# Altium project RFSOC_SAWG.PrjPCB (part 2 of 10)

## Sheet FireFly_AB.SchDoc: RFSOC_SAWG
size 420 x 297 mm; PageSetup: Record=PageOptions|CenterHorizontal=True|CenterVertical=True|PrintScale=0.97|XCorrection=1.00|YCorrection=1.00|PrintKind=0|BorderSize=5000000|LeftOffset=0|BottomOffset=0|Orientation=2|PaperLength=2970|PaperWidth=2100|Scale=100|PaperSource=7|PrintQuality=-4|MediaType=1|DitherType=10|PrintScaleMode=1|PaperKind=A4|PaperIndex=9; Author: G.Kasprowicz; CompanyName: WUT ISE; DrawnBy: G.Kasprowicz; Organization: WUT ISE; Address1: PW ISE; Address2: Nowowiejska 15/19 00-665 Warsaw; Address3: gkasprow@gmail.com; DocumentNumber: 13; Revision: 1; SheetNumber: 13; SheetTotal: 20; ModifiedBy: -; CheckedDate: -; Title2: FireFly AB; DivGrp: WUT ISE; Designer: G.Kasprowicz; ModifiedDate: -; ProjectName: Sensor Box
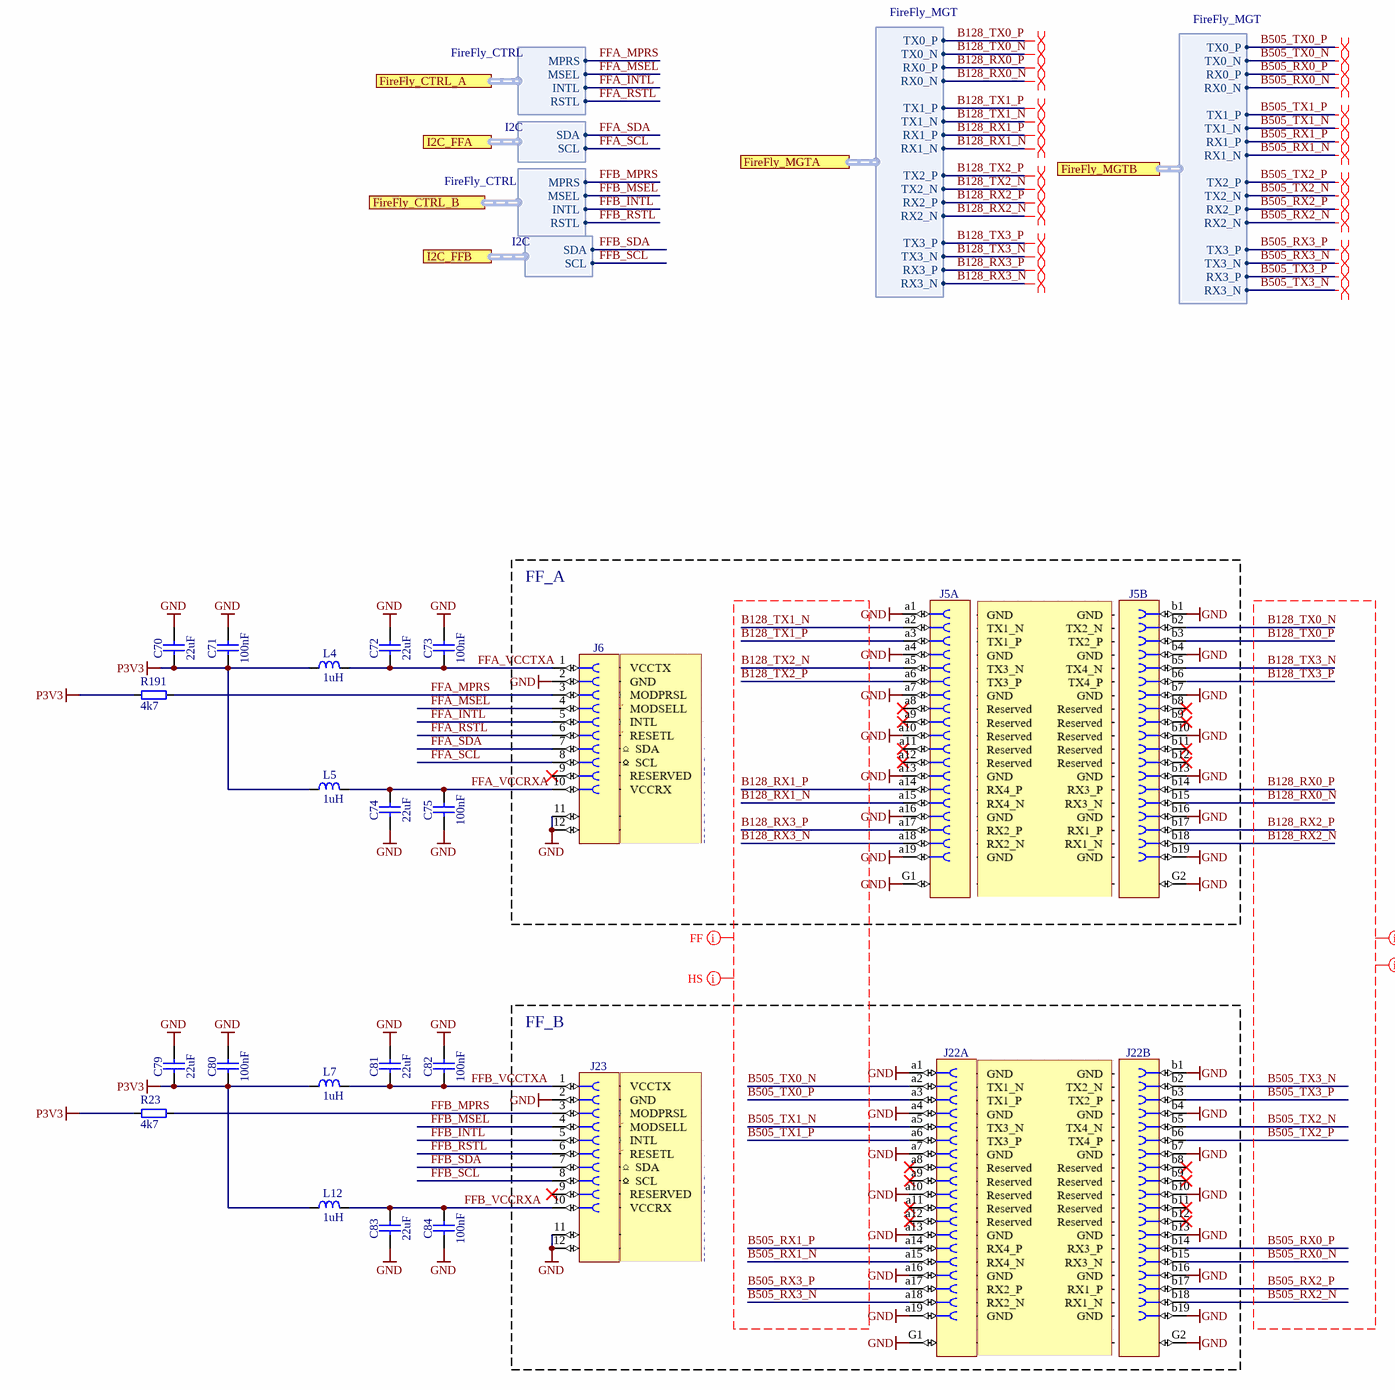
[diagram p2: FireFly_AB.SchDoc]

### Parts
C70  22uF  [CAPC2012X135N]
C71  100nF  [CAPC1005X55N]
C72  22uF  [CAPC2012X135N]
C73  100nF  [CAPC1005X55N]
C74  22uF  [CAPC2012X135N]
C75  100nF  [CAPC1005X55N]
C79  22uF  [CAPC2012X135N]
C80  100nF  [CAPC1005X55N]
C81  22uF  [CAPC2012X135N]
C82  100nF  [CAPC1005X55N]
C83  22uF  [CAPC2012X135N]
C84  100nF  [CAPC1005X55N]
J5  Socket 38  [SAMTEC_UEC5-019-2-H-D-RA-1]  (value not drawn)  (parts A,B of 2)
J6  Socket 10  [SAMTEC_UCC8-010-1-H-S-1-A]  (value not drawn)
J22  Socket 38  [SAMTEC_UEC5-019-2-H-D-RA-1]  (value not drawn)  (parts A,B of 2)
J23  Socket 10  [SAMTEC_UCC8-010-1-H-S-1-A]  (value not drawn)
L4  1uH  [INDC2520X120N]
L5  1uH  [INDC2520X120N]
L7  1uH  [INDC2520X120N]
L12  1uH  [INDC2520X120N]
R23  4k7  [RESC1005X40N]
R191  4k7  [RESC1005X40N]

### Blocks framed on the sheet
FF_A: J5 J6
FF_B: J22 J23

### Ports
FireFly_CTRL_A (harness FireFly_CTRL), FireFly_CTRL_B (harness FireFly_CTRL), FireFly_MGTA (harness FireFly_MGT), FireFly_MGTB (harness FireFly_MGT), I2C_FFA (harness I2C), I2C_FFB (harness I2C)

### Harnesses
I2C: SDA, SCL
FireFly_MGT: RX1_P, RX1_N, RX2_P, RX2_N, RX3_P, RX3_N, RX0_P, RX0_N, TX1_P, TX1_N, TX2_P, TX2_N, TX3_P, TX3_N, TX0_P, TX0_N
FireFly_CTRL: MPRS, MSEL, INTL, RSTL

### Nets
GND: C70.2 C71.2 C72.2 C73.2 C74.1 C75.1 C79.2 C80.2 C81.2 C82.2 C83.1 C84.1 J5.a1 J5.a4 J5.a7 J5.a10 J5.a13 J5.a16 J5.a19 J5.b1 J5.b4 J5.b7 J5.b10 J5.b13 J5.b16 J5.b19 J5.G1 J5.G2 J6.2 J6.11 J6.12 J22.a1 J22.a4 J22.a7 J22.a10 J22.a13 J22.a16 J22.a19 J22.b1 J22.b4 J22.b7 J22.b10 J22.b13 J22.b16 J22.b19 J22.G1 J22.G2 J23.2 J23.11 J23.12
P3V3: C70.1 C71.1 C79.1 C80.1 L4.1 L5.1 L7.1 L12.1 R23.1 R191.1
B128_RX0_N: J5.b15 ; port FireFly_MGTA.RX0_N
B128_RX0_P: J5.b14 ; port FireFly_MGTA.RX0_P
B128_RX1_N: J5.a15 ; port FireFly_MGTA.RX1_N
B128_RX1_P: J5.a14 ; port FireFly_MGTA.RX1_P
B128_RX2_N: J5.b18 ; port FireFly_MGTA.RX2_N
B128_RX2_P: J5.b17 ; port FireFly_MGTA.RX2_P
B128_RX3_N: J5.a18 ; port FireFly_MGTA.RX3_N
B128_RX3_P: J5.a17 ; port FireFly_MGTA.RX3_P
B128_TX0_N: J5.b2 ; port FireFly_MGTA.TX0_N
B128_TX0_P: J5.b3 ; port FireFly_MGTA.TX0_P
B128_TX1_N: J5.a2 ; port FireFly_MGTA.TX1_N
B128_TX1_P: J5.a3 ; port FireFly_MGTA.TX1_P
B128_TX2_N: J5.a5 ; port FireFly_MGTA.TX2_N
B128_TX2_P: J5.a6 ; port FireFly_MGTA.TX2_P
B128_TX3_N: J5.b5 ; port FireFly_MGTA.TX3_N
B128_TX3_P: J5.b6 ; port FireFly_MGTA.TX3_P
B505_RX0_N: J22.b15 ; port FireFly_MGTB.RX0_N
B505_RX0_P: J22.b14 ; port FireFly_MGTB.RX0_P
B505_RX1_N: J22.a15 ; port FireFly_MGTB.RX1_N
B505_RX1_P: J22.a14 ; port FireFly_MGTB.RX1_P
B505_RX2_N: J22.b18 ; port FireFly_MGTB.RX2_N
B505_RX2_P: J22.b17 ; port FireFly_MGTB.RX2_P
B505_RX3_N: J22.a18 ; port FireFly_MGTB.TX3_N
B505_RX3_P: J22.a17 ; port FireFly_MGTB.TX3_P
B505_TX0_N: J22.a2 ; port FireFly_MGTB.TX0_N
B505_TX0_P: J22.a3 ; port FireFly_MGTB.TX0_P
B505_TX1_N: J22.a5 ; port FireFly_MGTB.TX1_N
B505_TX1_P: J22.a6 ; port FireFly_MGTB.TX1_P
B505_TX2_N: J22.b5 ; port FireFly_MGTB.TX2_N
B505_TX2_P: J22.b6 ; port FireFly_MGTB.TX2_P
B505_TX3_N: J22.b2 ; port FireFly_MGTB.RX3_N
B505_TX3_P: J22.b3 ; port FireFly_MGTB.RX3_P
FFA_INTL: J6.5 ; port FireFly_CTRL_A.INTL
FFA_MPRS: J6.3 R191.2 ; port FireFly_CTRL_A.MPRS
FFA_MSEL: J6.4 ; port FireFly_CTRL_A.MSEL
FFA_RSTL: J6.6 ; port FireFly_CTRL_A.RSTL
FFA_SCL: J6.8 ; port I2C_FFA.SCL
FFA_SDA: J6.7 ; port I2C_FFA.SDA
FFA_VCCRXA: C74.2 C75.2 J6.10 L5.2
FFA_VCCTXA: C72.1 C73.1 J6.1 L4.2
FFB_INTL: J23.5 ; port FireFly_CTRL_B.INTL
FFB_MPRS: J23.3 R23.2 ; port FireFly_CTRL_B.MPRS
FFB_MSEL: J23.4 ; port FireFly_CTRL_B.MSEL
FFB_RSTL: J23.6 ; port FireFly_CTRL_B.RSTL
FFB_SCL: J23.8 ; port I2C_FFB.SCL
FFB_SDA: J23.7 ; port I2C_FFB.SDA
FFB_VCCRXA: C83.2 C84.2 J23.10 L12.2
FFB_VCCTXA: C81.1 C82.1 J23.1 L7.2

Not connected (* = marked no-connect by the designer): J5 a8(8)* a9(9)* a11(11)* a12(12)* b8(8)* b9(9)* b11(11)* b12(12)*; J6 9*; J22 a8(8)* a9(9)* a11(11)* a12(12)* b8(8)* b9(9)* b11(11)* b12(12)*; J23 9*

### Layout directives
net class HS: B128_RX0_N, B128_RX0_P, B128_RX1_N, B128_RX1_P, B128_RX2_N, B128_RX2_P, B128_RX3_N, B128_RX3_P, B128_TX0_N, B128_TX0_P, B128_TX1_N, B128_TX1_P, B128_TX2_N, B128_TX2_P, B128_TX3_N, B128_TX3_P, B505_RX0_N, B505_RX0_P, B505_RX1_N, B505_RX1_P, B505_RX2_N, B505_RX2_P, B505_RX3_N, B505_RX3_P, B505_TX0_N, B505_TX0_P, B505_TX1_N, B505_TX1_P, B505_TX2_N, B505_TX2_P, B505_TX3_N, B505_TX3_P
net class FF: B128_RX0_N, B128_RX0_P, B128_RX1_N, B128_RX1_P, B128_RX2_N, B128_RX2_P, B128_RX3_N, B128_RX3_P, B128_TX0_N, B128_TX0_P, B128_TX1_N, B128_TX1_P, B128_TX2_N, B128_TX2_P, B128_TX3_N, B128_TX3_P, B505_RX0_N, B505_RX0_P, B505_RX1_N, B505_RX1_P, B505_RX2_N, B505_RX2_P, B505_RX3_N, B505_RX3_P, B505_TX0_N, B505_TX0_P, B505_TX1_N, B505_TX1_P, B505_TX2_N, B505_TX2_P, B505_TX3_N, B505_TX3_P
differential pair: B128_RX0_N, B128_RX0_P, B128_RX1_N, B128_RX1_P, B128_RX2_N, B128_RX2_P, B128_RX3_N, B128_RX3_P, B128_TX0_N, B128_TX0_P, B128_TX1_N, B128_TX1_P, B128_TX2_N, B128_TX2_P, B128_TX3_N, B128_TX3_P, B505_RX0_N, B505_RX0_P, B505_RX1_N, B505_RX1_P, B505_RX2_N, B505_RX2_P, B505_RX3_N, B505_RX3_P, B505_TX0_N, B505_TX0_P, B505_TX1_N, B505_TX1_P, B505_TX2_N, B505_TX2_P, B505_TX3_N, B505_TX3_P

### Notes on the sheet
- Project/Equipment
- Document
- Designer
- Drawn by
- Check.by
- Copyright WUT ISE 2020.
  This documentation describes Open Hardware and is licensed under the CERN OHL v.1.2. You may redistribute and modify this documentation under the terms of the CERN OHL v.1.2. (http://ohwr.org/CERNOHL). This documentation is distributed WITHOUT ANY EXPRESS OR IMPLIED WARRANTY, INCLUDING OF MERCHANTABILITY, SATISFACTORY QUALITY AND FITNESS FOR A PARTICULAR PURPOSE. Please see the CERN OHL v.1.2 for applicable conditions.
- Contact
- File
- Last Mod.
- Print Date
- Sheet
- Size
- A3
- of
- Rev

### Library data of the parts
C70 C72 C74 C79 C81 C83 = CC0805_22UF_16V_10%_X5R: Non-polarised capacitor; Part Description: SMD Multilayer Chip Ceramic Capacitor; Manufacturer: GENERIC; Manufacturer1 Part Number: C2012X5R1C226KT; Voltage: 16V; TC: X5R; Tolerance: ±10%; Part Number: CC0805_22UF_16V_10%_X5R; Component Kind: Standard; Component Type: Standard; Pin Count: 2; Value: 22uF; Status: Preferred; Manufacturer Part Number: CC0805_22UF_16V_10%_X5R; Case: 0805; Mounted: Yes; Socket: No; SMD: Yes; Sense: No; Manufacturer1 Example: TDK; Manufacturer1 ComponentHeight: 1.35mm; HelpURL: \\cern.ch\dfs\Applications\Altium\Datasheets\CC0805_X5R_TDK_C.pdf; Author: CERN DEM JLC; CreateDate: 25.10.2012; LatestRevisionDate: 25.10.2012
C71 C73 C75 C80 C82 C84 = CC0402_100NF_16V_10%_X7R: as C225 on sheet AWG_CLK_Connectors; Part Number: CC0402_100NF_16V_10%_X7R; Component Kind: Standard; Component Type: Standard; Pin Count: 2; Value: 100nF; Status: Not Recommended; Manufacturer Part Number: CC0402_100NF_16V_10%_X7R; Case: 0402; Mounted: Yes; Socket: No; SMD: Yes; Sense: No; Manufacturer1 Example: MURATA; Manufacturer1 ComponentHeight: 0.55mm; HelpURL: \\cern.ch\dfs\Applications\Altium\Datasheets\CC0402_X7R_MURATA_GRM.pdf; Author: CERN DEM JLC; CreateDate: 05/12/2013; LatestRevisionDate: 03/12/2007
J5 J22 = SAMTEC_UEC5-019-2-H-D-RA-1: Connector 38ab Female (2x19) + 2x1; Part Description: 38 Contacts, Pitch 0.5mm, Rugged Micro Flyover Socket System; Manufacturer: SAMTEC; PressFit: No; Part Number: SAMTEC_UEC5-019-2-H-D-RA-1; Component Kind: Standard; Component Type: Standard; Pin Count: 38; Family: Socket 38; Mounted: Yes; Socket: No; SMD: Yes; Sense: No; Status: None; Manufacturer Part Number: UEC5-019-2-H-D-RA-1; ComponentHeight: 3.46mm; HelpURL: \\cern.ch\dfs\Applications\Altium\Datasheets\SAMTEC_UEC5-019-2-H-D-RA-1.pdf; Author: CERN DEM BR; CreateDate: 06.06.2019; LatestRevisionDate: 06.06.2019
J6 J23 = SAMTEC_UCC8-010-1-H-S-1-A: Connector 10 Female + 2; Part Description: 10 Contacts, Pitch 0.8mm, Rugged Micro Flyover Socket System; Manufacturer: SAMTEC; PressFit: No; Part Number: SAMTEC_UCC8-010-1-H-S-1-A; Component Kind: Standard; Component Type: Standard; Pin Count: 10; Family: Socket 10; Mounted: Yes; Socket: No; SMD: Yes; Sense: No; Status: None; Manufacturer Part Number: UCC8-010-1-H-S-1-A; ComponentHeight: 3.95mm; HelpURL: \\cern.ch\dfs\Applications\Altium\Datasheets\SAMTEC_UCC8-010-1-H-S-1-A.pdf; Author: CERN DEM JLC; CreateDate: 09.06.2015; LatestRevisionDate: 09.06.2015
L4 L5 L7 L12 = IND1008_1UH_20%_TDK_TFM252012ALVA1R0M: Inductor; Part Description: Inductors for Power Circuits Thin-Film Metal Magnetic Material (TFM-ALVA Series for Automotive); Manufacturer: TDK; Tolerance: ±20%; Power: 4.7A; Resistance: 0.035R; Case: 1008; Value: 1uH; HelpURL: \\cern.ch\dfs\Applications\Altium\Datasheets\IND_TDK_TFM252012ALVA.pdf; Part Number: IND1008_1UH_20%_TDK_TFM252012ALVA1R0M; Component Kind: Standard; Component Type: Standard; Pin Count: 2; Manufacturer Part Number: TFM252012ALVA1R0M; Mounted: Yes; Socket: No; SMD: Yes; Sense: No; ComponentHeight: 1.2mm; Author: CERN DEM BC; CreateDate: 16.04.2020; LatestRevisionDate: 16.04.2020
R23 R191 = R0402_4K7_1%_0.0625W_100PPM: Resistor - 1%; Part Description: General Purpose Thick Film Chip Resistor; Manufacturer: GENERIC; Manufacturer1 Part Number: 232270674702L; TC: ±100ppm/°C; PressFit: No; Case: 0402; Value: 4k7; Tolerance: ±1%; Part Number: R0402_4K7_1%_0.0625W_100PPM; Component Kind: Standard; Component Type: Standard; Pin Count: 2; Status: Not Recommended; Power: 0.0625W; Manufacturer Part Number: R0402_4K7_1%_0.0625W_100PPM; Mounted: Yes; Sense: No; Socket: No; SMD: Yes; Manufacturer1 Example: YAGEO PHYCOMP; Manufacturer1 ComponentHeight: 0.4mm; HelpURL: \\cern.ch\dfs\Applications\Altium\Datasheets\R0402_Phycomp_RC0402.pdf; Author: CERN DEM JLC; CreateDate: 03.12.2007; LatestRevisionDate: 17.10.2012

## Sheet I2C_MUX.SchDoc: RFSOC_SAWG
size 420 x 297 mm; Author: G.Kasprowicz; CompanyName: WUT ISE; DrawnBy: G.Kasprowicz; Organization: WUT ISE; Address1: PW ISE; Address2: Nowowiejska 15/19 00-665 Warsaw; Address3: gkasprow@gmail.com; DocumentNumber: 14; Revision: 1; SheetNumber: 14; SheetTotal: 20; ModifiedBy: -; CheckedDate: -; Title2: I2C_MUX; DivGrp: WUT ISE; Designer: G.Kasprowicz; ModifiedDate: -; ProjectName: Sensor Box
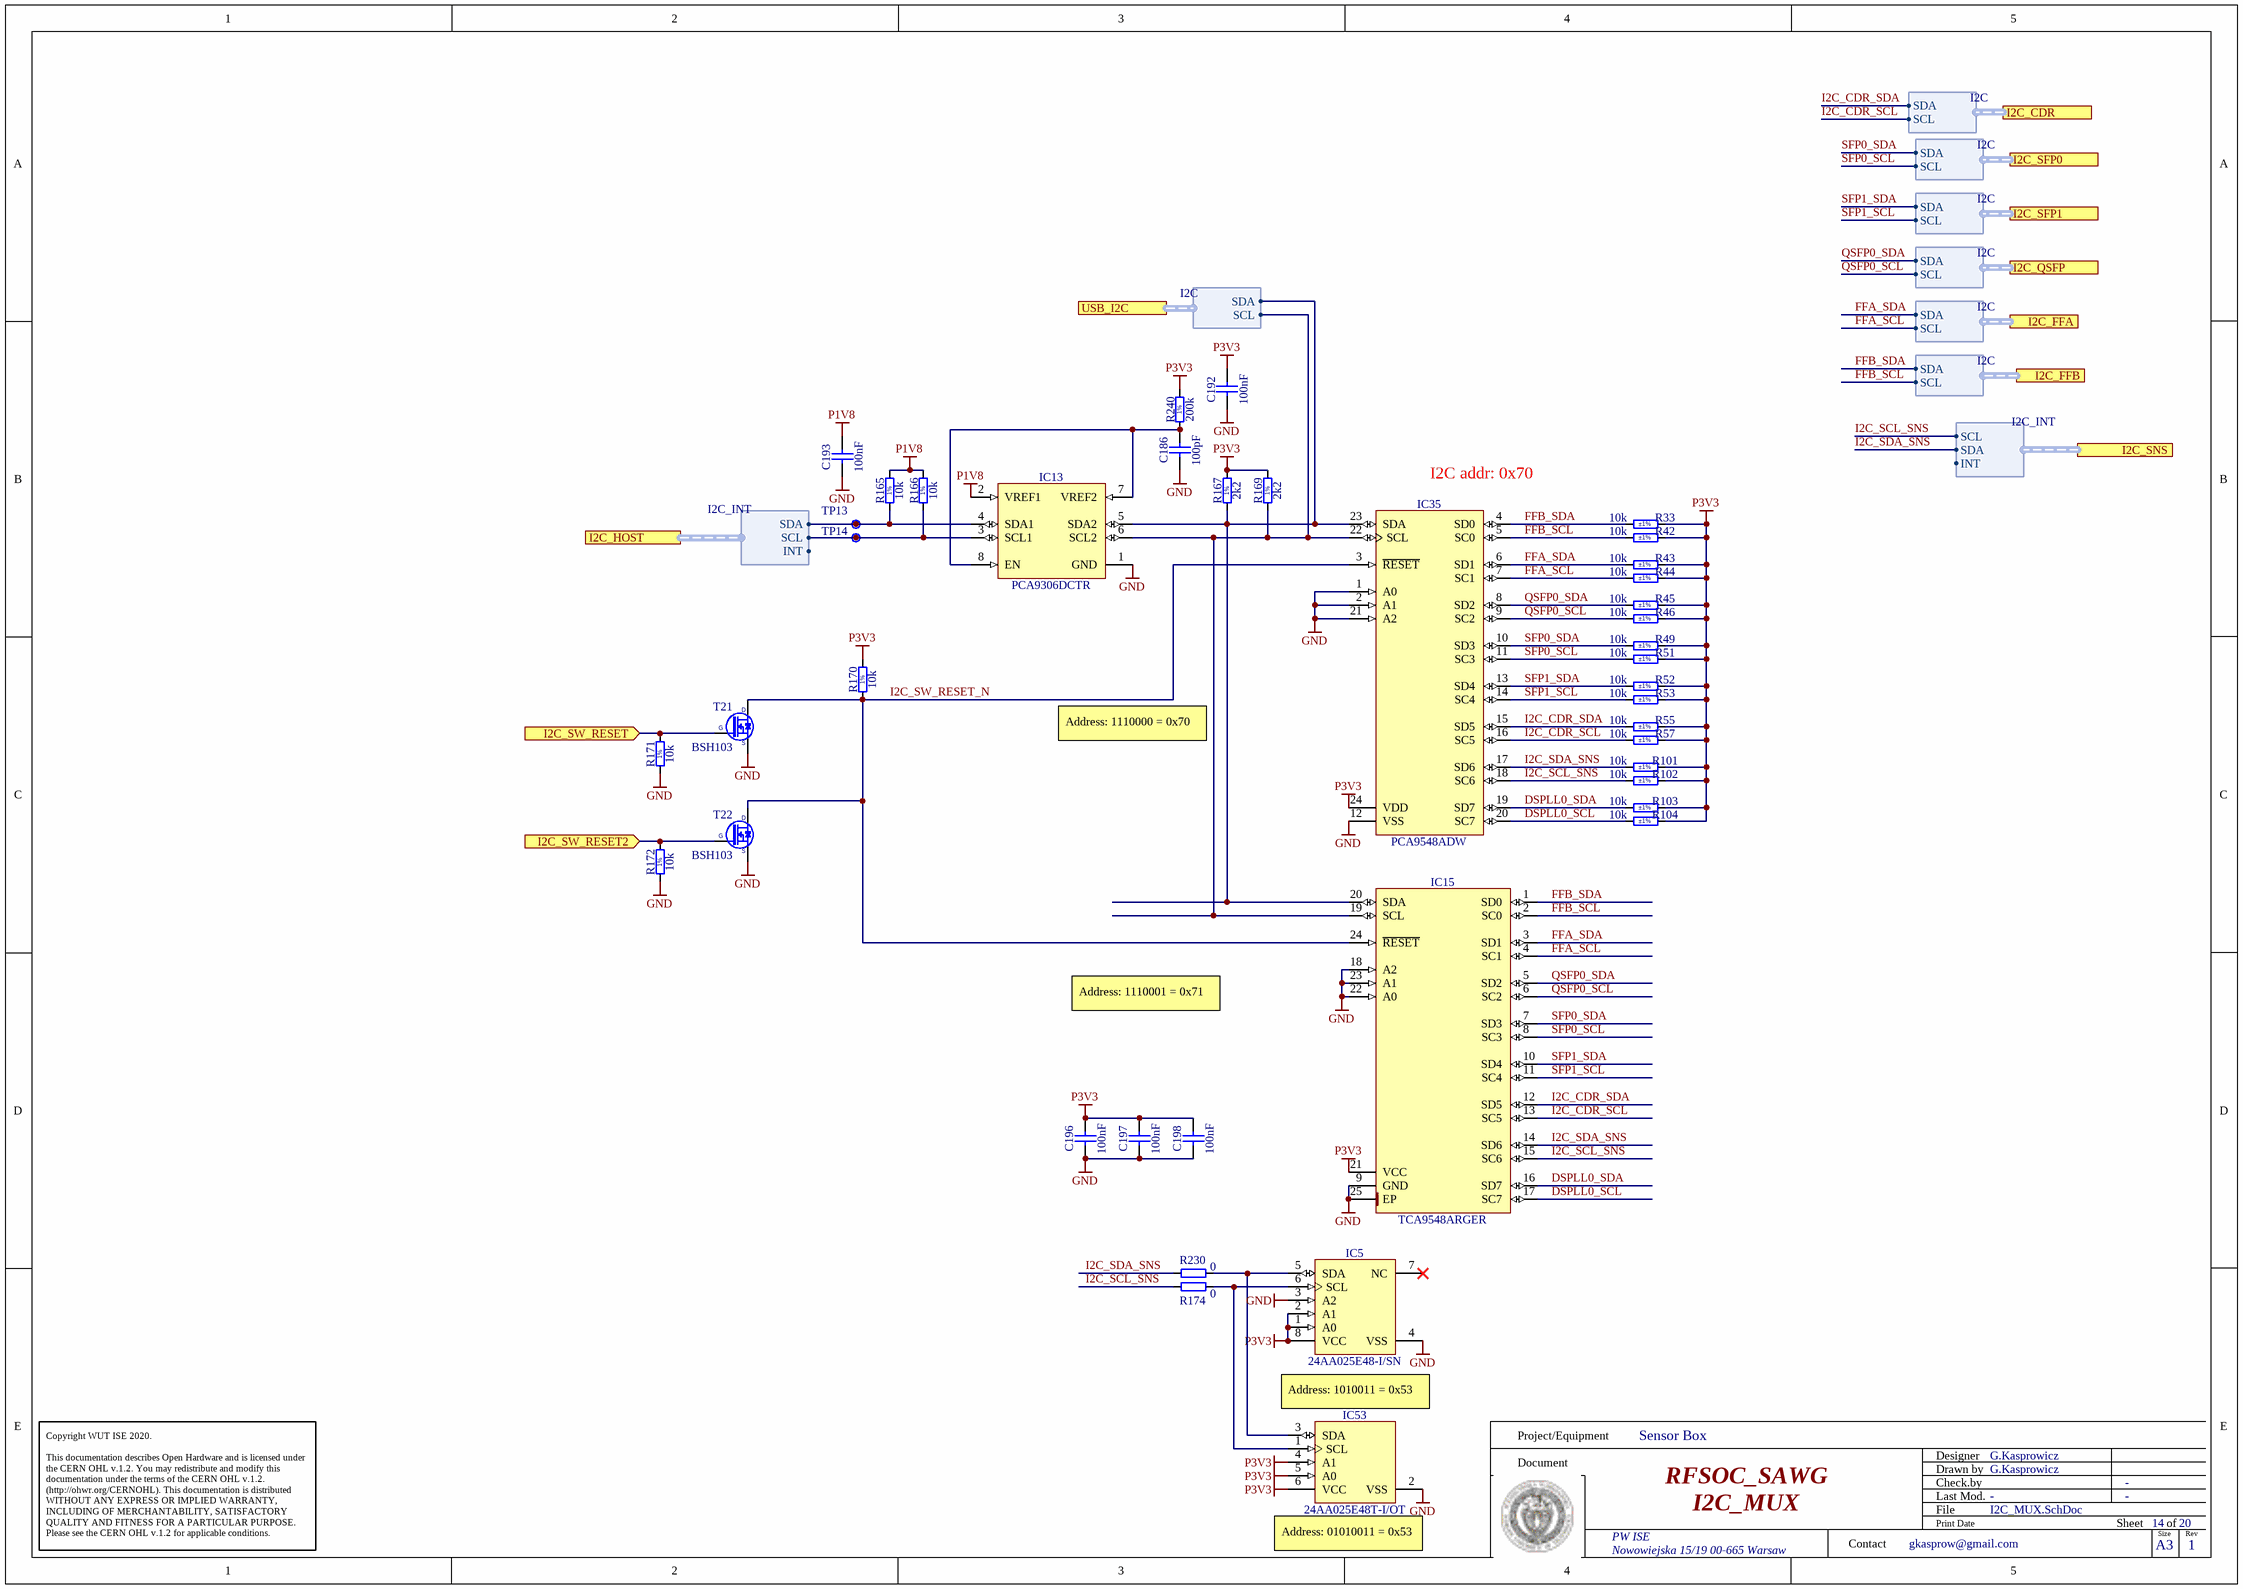
[diagram p3: I2C_MUX.SchDoc]

### Parts
C186  100pF  [CAPC1005X55N]
C192  100nF  [CAPC1005X55N]
C193  100nF  [CAPC1005X55N]
C196  100nF  [CAPC1005X55N]
C197  100nF  [CAPC1005X55N]
C198  100nF  [CAPC1005X55N]
IC5  24AA025E48-I/SN  [SOIC127P600X175-8N]
IC13  PCA9306DCTR  [SOP65P400X130-8N]
IC15  TCA9548ARGER  [QFN50P400X400X100-25N-S220]
IC35  PCA9548ADW  [SOIC127P1030X265-24N]
IC53  24AA025E48T-I/OT  [SOT95P280X145-6N]
R33  10k  Tolerance: ±1%  [RESC1005X40N]
R42  10k  Tolerance: ±1%  [RESC1005X40N]
R43  10k  Tolerance: ±1%  [RESC1005X40N]
R44  10k  Tolerance: ±1%  [RESC1005X40N]
R45  10k  Tolerance: ±1%  [RESC1005X40N]
R46  10k  Tolerance: ±1%  [RESC1005X40N]
R49  10k  Tolerance: ±1%  [RESC1005X40N]
R51  10k  Tolerance: ±1%  [RESC1005X40N]
R52  10k  Tolerance: ±1%  [RESC1005X40N]
R53  10k  Tolerance: ±1%  [RESC1005X40N]
R55  10k  Tolerance: ±1%  [RESC1005X40N]
R57  10k  Tolerance: ±1%  [RESC1005X40N]
R101  10k  Tolerance: ±1%  [RESC1005X40N]
R102  10k  Tolerance: ±1%  [RESC1005X40N]
R103  10k  Tolerance: ±1%  [RESC1005X40N]
R104  10k  Tolerance: ±1%  [RESC1005X40N]
R165  10k  [RESC1005X40N]
R166  10k  [RESC1005X40N]
R167  2k2  [RESC1005X40N]
R169  2k2  [RESC1005X40N]
R170  10k  [RESC1005X40N]
R171  10k  [RESC1005X40N]
R172  10k  [RESC1005X40N]
R174  0  [RESC1005X40N]
R230  0  [RESC1005X40N]
R240  200k  [RESC1005X40N]
T21  BSH103  [SOT95P230X110-3N]
T22  BSH103  [SOT95P230X110-3N]
TP13  Test Point  [TPS127]  (value not drawn)  (no BOM)
TP14  Test Point  [TPS127]  (value not drawn)  (no BOM)

### Ports
I2C_CDR (harness I2C), I2C_FFA (harness I2C), I2C_FFB (harness I2C), I2C_HOST (harness I2C_INT), I2C_QSFP (harness I2C), I2C_SFP0 (harness I2C), I2C_SFP1 (harness I2C), I2C_SNS (harness I2C_INT), I2C_SW_RESET2 (in), I2C_SW_RESET (in), USB_I2C (harness I2C)

### Harnesses
I2C: SDA, SCL
I2C_INT: SDA, SCL, INT

### Nets
GND: C186.1 C192.1 C193.1 C196.1 C197.1 C198.1 IC5.3(A2) IC5.4(VSS) IC13.1(GND) IC15.9(GND) IC15.18(A2) IC15.22(A0) IC15.23(A1) IC15.25(EP) IC35.1(A0) IC35.2(A1) IC35.12(VSS) IC35.21(A2) IC53.2(VSS) R171.1 R172.1 T21.2(S) T22.2(S)
P1V8: C193.2 IC13.2(VREF1) R165.2 R166.2
P3V3: C192.2 C196.2 C197.2 C198.2 IC5.1(A0) IC5.2(A1) IC5.8(VCC) IC15.21(VCC) IC35.24(VDD) IC53.4(A1) IC53.5(A0) IC53.6(VCC) R33.2 R42.2 R43.2 R44.2 R45.2 R46.2 R49.2 R51.2 R52.2 R53.2 R55.2 R57.2 R101.2 R102.2 R103.2 R104.2 R167.2 R169.2 R170.2 R240.2
ALERT_N: port I2C_HOST.INT, port I2C_SNS.INT
DSPLL0_SCL: IC15.17(SC7) IC35.20(SC7) R104.1
DSPLL0_SDA: IC15.16(SD7) IC35.19(SD7) R103.1
FFA_SCL: IC15.4(SC1) IC35.7(SC1) R44.1 ; port I2C_FFA.SCL
FFA_SDA: IC15.3(SD1) IC35.6(SD1) R43.1 ; port I2C_FFA.SDA
FFB_SCL: IC15.2(SC0) IC35.5(SC0) R42.1 ; port I2C_FFB.SCL
FFB_SDA: IC15.1(SD0) IC35.4(SD0) R33.1 ; port I2C_FFB.SDA
I2C0_1V8_SCL: IC13.3(SCL1) R166.1 TP14.1 ; port I2C_HOST.SCL
I2C0_1V8_SDA: IC13.4(SDA1) R165.1 TP13.1 ; port I2C_HOST.SDA
I2C_CDR_SCL: IC15.13(SC5) IC35.16(SC5) R57.1 ; port I2C_CDR.SCL
I2C_CDR_SDA: IC15.12(SD5) IC35.15(SD5) R55.1 ; port I2C_CDR.SDA
I2C_SCL_SNS: IC15.15(SC6) IC35.18(SC6) R102.1 R174.1 ; port I2C_SNS.SCL
I2C_SDA_SNS: IC15.14(SD6) IC35.17(SD6) R101.1 R230.1 ; port I2C_SNS.SDA
I2C_SW_RESET: R171.2 T21.1(G) ; port I2C_SW_RESET
I2C_SW_RESET2: R172.2 T22.1(G) ; port I2C_SW_RESET2
I2C_SW_RESET_N: IC15.24(~{RESET}) IC35.3(~{RESET}) R170.1 T21.3(D) T22.3(D)
QSFP0_SCL: IC15.6(SC2) IC35.9(SC2) R46.1 ; port I2C_QSFP.SCL
QSFP0_SDA: IC15.5(SD2) IC35.8(SD2) R45.1 ; port I2C_QSFP.SDA
SFP0_SCL: IC15.8(SC3) IC35.11(SC3) R51.1 ; port I2C_SFP0.SCL
SFP0_SDA: IC15.7(SD3) IC35.10(SD3) R49.1 ; port I2C_SFP0.SDA
SFP1_SCL: IC15.11(SC4) IC35.14(SC4) R53.1 ; port I2C_SFP1.SCL
SFP1_SDA: IC15.10(SD4) IC35.13(SD4) R52.1 ; port I2C_SFP1.SDA
USB_SCL: IC13.6(SCL2) IC15.19(SCL) IC35.22(SCL) R169.1 ; port USB_I2C.SCL
USB_SDA: IC13.5(SDA2) IC15.20(SDA) IC35.23(SDA) R167.1 ; port USB_I2C.SDA
NetC186_2: C186.2 IC13.7(VREF2) IC13.8(EN) R240.1
NetIC5_5: IC5.5(SDA) IC53.3(SDA) R230.2
NetIC5_6: IC5.6(SCL) IC53.1(SCL) R174.2

Not connected (* = marked no-connect by the designer): IC5 7(NC)*

### Notes on the sheet
- (near IC35) I2C addr: 0x70
- Address: 1110000 = 0x70
- Address: 1110001 = 0x71
- Address: 1010011 = 0x53
- (near IC53) Address: 01010011 = 0x53
- Project/Equipment
- Document
- Designer
- Drawn by
- Check.by
- Copyright WUT ISE 2020.
  This documentation describes Open Hardware and is licensed under the CERN OHL v.1.2. You may redistribute and modify this documentation under the terms of the CERN OHL v.1.2. (http://ohwr.org/CERNOHL). This documentation is distributed WITHOUT ANY EXPRESS OR IMPLIED WARRANTY, INCLUDING OF MERCHANTABILITY, SATISFACTORY QUALITY AND FITNESS FOR A PARTICULAR PURPOSE. Please see the CERN OHL v.1.2 for applicable conditions.
- Contact
- File
- Last Mod.
- Print Date
- Sheet
- Size
- A3
- of
- Rev
- (in symbol R0402_2K2_1%_0.0625W_100PPM) 1%
- (in symbol R0402_10K_1%_0.0625W_100PPM) 1%
- (in symbol R0402_200K_1%_0.0625W_100PPM) 1%

### Library data of the parts
C186 = CC0402_100PF_50V_5%_C0G: Non-polarised capacitor; Part Description: SMD Multilayer Chip Ceramic Capacitor; Manufacturer: GENERIC; Manufacturer1 Part Number: C0402C101J5GACTU; Voltage: 50V; TC: C0G/NP0; Tolerance: ±5%; Part Number: CC0402_100PF_50V_5%_C0G; Component Kind: Standard; Component Type: Standard; Pin Count: 2; Value: 100pF; Status: Preferred; Manufacturer Part Number: CC0402_100PF_50V_5%_C0G; Case: 0402; Mounted: Yes; Socket: No; SMD: Yes; Sense: No; Manufacturer1 Example: KEMET; Manufacturer1 ComponentHeight: 0.55mm; HelpURL: \\cern.ch\dfs\Applications\Altium\Datasheets\CC0805_C0G_KEMET_(Commercial Grade).pdf; Author: CERN DEM JLC; CreateDate: 03.12.2007; LatestRevisionDate: 22.04.2015
C192 C193 C196-C198 = CC0402_100NF_16V_10%_X7R: as C225 on sheet AWG_CLK_Connectors; Part Number: CC0402_100NF_16V_10%_X7R; Component Kind: Standard; Component Type: Standard; Pin Count: 2; Value: 100nF; Status: Not Recommended; Manufacturer Part Number: CC0402_100NF_16V_10%_X7R; Case: 0402; Mounted: Yes; Socket: No; SMD: Yes; Sense: No; Manufacturer1 Example: MURATA; Manufacturer1 ComponentHeight: 0.55mm; HelpURL: \\cern.ch\dfs\Applications\Altium\Datasheets\CC0402_X7R_MURATA_GRM.pdf; Author: CERN DEM JLC; CreateDate: 05/12/2013; LatestRevisionDate: 03/12/2007
IC5 = 24AA025E48-I/SN: 1.7V-5.5V, 2K I2C™ Serial EEPROMs with EUI-48™ Node Identity; Manufacturer: MICROCHIP TECHNOLOGY; PressFit: No; Bonding: No; Part Number: 24AA025E48-I/SN; Component Kind: Standard; Component Type: Standard; Device: 24AA025E48-I/SN; PackageDescription: SOIC 8, Pitch 1.27mm - Body 4x5mm, IPC Medium Density; Part Description: 1.7V-5.5V, 2K I2C™ Serial EEPROMs with EUI-48™ Node Identity; Manufacturer Part Number: 24AA025E48-I/SN; Pin Count: 8; Case: SOIC8; Mounted: Yes; Socket: No; SMD: Yes; Sense: No; ComponentHeight: 1.75mm; HelpURL: \\cern.ch\dfs\Applications\Altium\Datasheets\24AA025E48-I-SN.pdf; Author: CERN DEM MR; CreateDate: 19.07.2016; LatestRevisionDate: 19.07.2016
IC13 = PCA9306DCTR: Dual Bidirectional I2C Bus And SMBus Voltage-Level Translator; Manufacturer: TEXAS INSTRUMENTS; PressFit: No; Bonding: No; Part Number: PCA9306DCTR; Component Kind: Standard; Component Type: Standard; Device: PCA9306DCTR; PackageDescription: SOP, 0.65mm, Pitch; 8 Pin, 2.80mm W X 2.95mm L X 1.30mm H Body, PC Medium Density; Part Description: Dual Bidirectional I2C Bus And SMBus Voltage-Level Translator; Manufacturer Part Number: PCA9306DCTR; Pin Count: 8; Case: SSOP8; Mounted: Yes; Socket: No; SMD: Yes; Sense: No; ComponentHeight: 1.3mm; Author: CERN DEM JLC; HelpURL: \\cern.ch\dfs\Applications\Altium\Datasheets\PCA9306DCTR.pdf; CreateDate: 25.02.2013; LatestRevisionDate: 11.02.2016
IC15 = TCA9548ARGER: Low Voltage 8-Channel I2C Switch With Reset; Manufacturer: TEXAS INSTRUMENTS; PressFit: No; Bonding: No; Part Number: TCA9548ARGER; Component Kind: Standard; Component Type: Standard; Device: TCA9548ARGER; PackageDescription: QFN, 0.50mm Pitch, Square; 24 Pin, 4.00mm L X 4.00mm W X 1.00mm H body (w/thermal tab 2.2 X 2.2mm), IPC Medium Density; Part Description: Low Voltage 8-Channel I2C Switch With Reset; Manufacturer Part Number: TCA9548ARGER; Pin Count: 25; Case: QFN24; Mounted: Yes; Socket: No; SMD: Yes; Sense: No; ComponentHeight: 1mm; Author: CERN DEM JLC; HelpURL: \\cern.ch\dfs\Applications\Altium\Datasheets\TCA9548ARGER.pdf; CreateDate: 07.07.2014; LatestRevisionDate: 07.07.2014
IC35 = PCA9548ADW: 8-Channel I2C-Bus Switch with Reset; Part Description: Low Voltage 8-Channel I2C Switch with Reset; Manufacturer: TEXAS INSTRUMENTS; PressFit: No; Bonding: No; Part Number: PCA9548ADW; Component Kind: Standard; Component Type: Standard; Device: PCA9548ADW; PackageDescription: SOIC, 1.27mm Pitch; 24 Pin, 7.50mm W X 15.4mm L X 2.65mm H body, IPC Medium Density; Manufacturer Part Number: PCA9548ADW; Pin Count: 24; Case: SOIC24; Mounted: Yes; Socket: No; SMD: Yes; Sense: No; ComponentHeight: 2.65mm; Author: CERN DEM JLC; HelpURL: \\cern.ch\dfs\Applications\Altium\Datasheets\PCA9548ADW.pdf; CreateDate: 19.07.2017; LatestRevisionDate: 19.07.2017
IC53 = 24AA025E48T-I/OT: 1.7V-5.5V, 2K I2C Serial EEPROM With EUI-48 Node Identity; Part Description: 1.7V-5.5V, 2K I2C Serial EEPROM with EUI-48™ Node Identity; Cascadable; Manufacturer: MICROCHIP TECHNOLOGY; PressFit: No; Bonding: No; Part Number: 24AA025E48T-I/OT; Component Kind: Standard; Component Type: Standard; Device: 24AA025E48T-I/OT; PackageDescription: SOT, 0.95mm pitch; 6 pin, 1.60mm W X 2.90mm L X 1.45mm H body, IPC Medium Density; Manufacturer Part Number: 24AA025E48T-I/OT; Pin Count: 6; Case: SOT23-6; Mounted: Yes; Socket: No; SMD: Yes; Sense: No; ComponentHeight: 1.45mm; HelpURL: \\cern.ch\dfs\Applications\Altium\Datasheets\24AA025E48T-I-OT.pdf; Author: CERN DEM BC; CreateDate: 06.12.2019; LatestRevisionDate: 06.12.2019
R33 R42-R46 R49 R51-R53 R55 R57 R101-R104 R165 R166 R170-R172 = R0402_10K_1%_0.0625W_100PPM: as R3#1 on sheet RFSOC_SAWG; Part Number: R0402_10K_1%_0.0625W_100PPM; Component Kind: Standard; Component Type: Standard; Pin Count: 2; Value: 10k; Status: Not Recommended; Power: 0.0625W; Manufacturer Part Number: R0402_10K_1%_0.0625W_100PPM; Case: 0402; Mounted: Yes; Sense: No; Socket: No; SMD: Yes; Manufacturer1 Example: YAGEO PHYCOMP; Manufacturer1 ComponentHeight: 0.4mm; HelpURL: \\cern.ch\dfs\Applications\Altium\Datasheets\R0402_Phycomp_RC0402.pdf; Author: CERN DEM JLC; CreateDate: 03.12.2007; LatestRevisionDate: 17.10.2012
  R165 R166 R170-R172: Tolerance: ±1%
R167 R169 = R0402_2K2_1%_0.0625W_100PPM: Resistor - 1%; Part Description: General Purpose Thick Film Chip Resistor; Manufacturer: GENERIC; Manufacturer1 Part Number: 232270672202L; TC: ±100ppm/°C; PressFit: No; Part Number: R0402_2K2_1%_0.0625W_100PPM; Component Kind: Standard; Component Type: Standard; Pin Count: 2; Value: 2k2; Status: Not Recommended; Power: 0.0625W; Tolerance: ±1%; Manufacturer Part Number: R0402_2K2_1%_0.0625W_100PPM; Case: 0402; Mounted: Yes; Sense: No; Socket: No; SMD: Yes; Manufacturer1 Example: YAGEO PHYCOMP; Manufacturer1 ComponentHeight: 0.4mm; HelpURL: \\cern.ch\dfs\Applications\Altium\Datasheets\R0402_Phycomp_RC0402.pdf; Author: CERN DEM JLC; CreateDate: 03.12.2007; LatestRevisionDate: 17.10.2012
R174 R230 = R0402_0R_JUMPER: as R106 on sheet RFSOC_SAWG; Part Number: R0402_0R_JUMPER; Component Kind: Standard; Component Type: Standard; Pin Count: 2; Value: 0; Status: Not Recommended; Manufacturer Part Number: R0402_0R_JUMPER; Case: 0402; Mounted: Yes; Sense: No; Socket: No; SMD: Yes; Manufacturer1 Example: YAGEO PHYCOMP; Manufacturer1 ComponentHeight: 0.4mm; HelpURL: \\cern.ch\dfs\Applications\Altium\Datasheets\R0402_Phycomp_RC0402.pdf; Author: CERN DEM JLC; CreateDate: 03.12.2007; LatestRevisionDate: 17.10.2012
R240 = R0402_200K_1%_0.0625W_100PPM: Resistor - 1%; Part Description: General Purpose Thick Film Chip Resistor; Manufacturer: GENERIC; Manufacturer1 Part Number: 232270672004L; TC: ±100ppm/°C; PressFit: No; Part Number: R0402_200K_1%_0.0625W_100PPM; Component Kind: Standard; Component Type: Standard; Pin Count: 2; Value: 200k; Status: Not Recommended; Power: 0.0625W; Tolerance: ±1%; Manufacturer Part Number: R0402_200K_1%_0.0625W_100PPM; Case: 0402; Mounted: Yes; Sense: No; Socket: No; SMD: Yes; Manufacturer1 Example: YAGEO PHYCOMP; Manufacturer1 ComponentHeight: 0.4mm; HelpURL: \\cern.ch\dfs\Applications\Altium\Datasheets\R0402_Phycomp_RC0402.pdf; Author: CERN DEM JLC; CreateDate: 03.12.2007; LatestRevisionDate: 17.10.2012
T21 T22 = BSH103: as T5 on sheet RFSOC_SAWG; Part Number: BSH103; Component Kind: Standard; Component Type: Standard; Device: BSH103; PackageDescription: SOT23, 3 pin, Pitch 0.95mm - 1.3mm W X 2.9mm L X 1.1mm H, IPC Medium Density; Manufacturer Part Number: BSH103; Pin Count: 3; Case: SOT23-3; Mounted: Yes; Socket: No; SMD: Yes; Sense: No; ComponentHeight: 1.1mm; HelpURL: \\cern.ch\dfs\Applications\Altium\Datasheets\BSH103.pdf; Author: CERN DEM JLC; CreateDate: 16.03.2010; LatestRevisionDate: 20.06.2017; ClassName: Artix
TP13 TP14 = SMD_PAD_1.27X1.27MM: Part Description: 1.27mm x 1.27mm PCB Copper Area (SMD Test Point); Mounted: No; Part Number: SMD_PAD_1.27X1.27MM; Component Type: Standard (No BOM); Pin Count: 1; Family: Test Point; Socket: No; SMD: Yes; Sense: No; Status: None; ComponentHeight: 0mm; HelpURL: Undefined; Author: CERN DEM JLC; CreateDate: 12.01.2008; LatestRevisionDate: 12.01.2008; PackageDescription: 1.27mm x 1.27mm PCB Copper Area (SMD Test Point)

## Sheet SD.SchDoc: RFSOC SAWG
size 420 x 297 mm; Author: G.Kasprowicz; CompanyName: WUT ISE; DrawnBy: G.Kasprowicz; Organization: WUT ISE; Address1: PW ISE; Address2: Nowowiejska 15/19 00-665 Warsaw; Address3: gkasprow@gmail.com; DocumentNumber: 19; Revision: 1; SheetNumber: 19; SheetTotal: 20; ModifiedBy: -; CheckedDate: -; Title2: SD; DivGrp: WUT ISE; Designer: G.Kasprowicz; ModifiedDate: -; ProjectName: Sensor Box
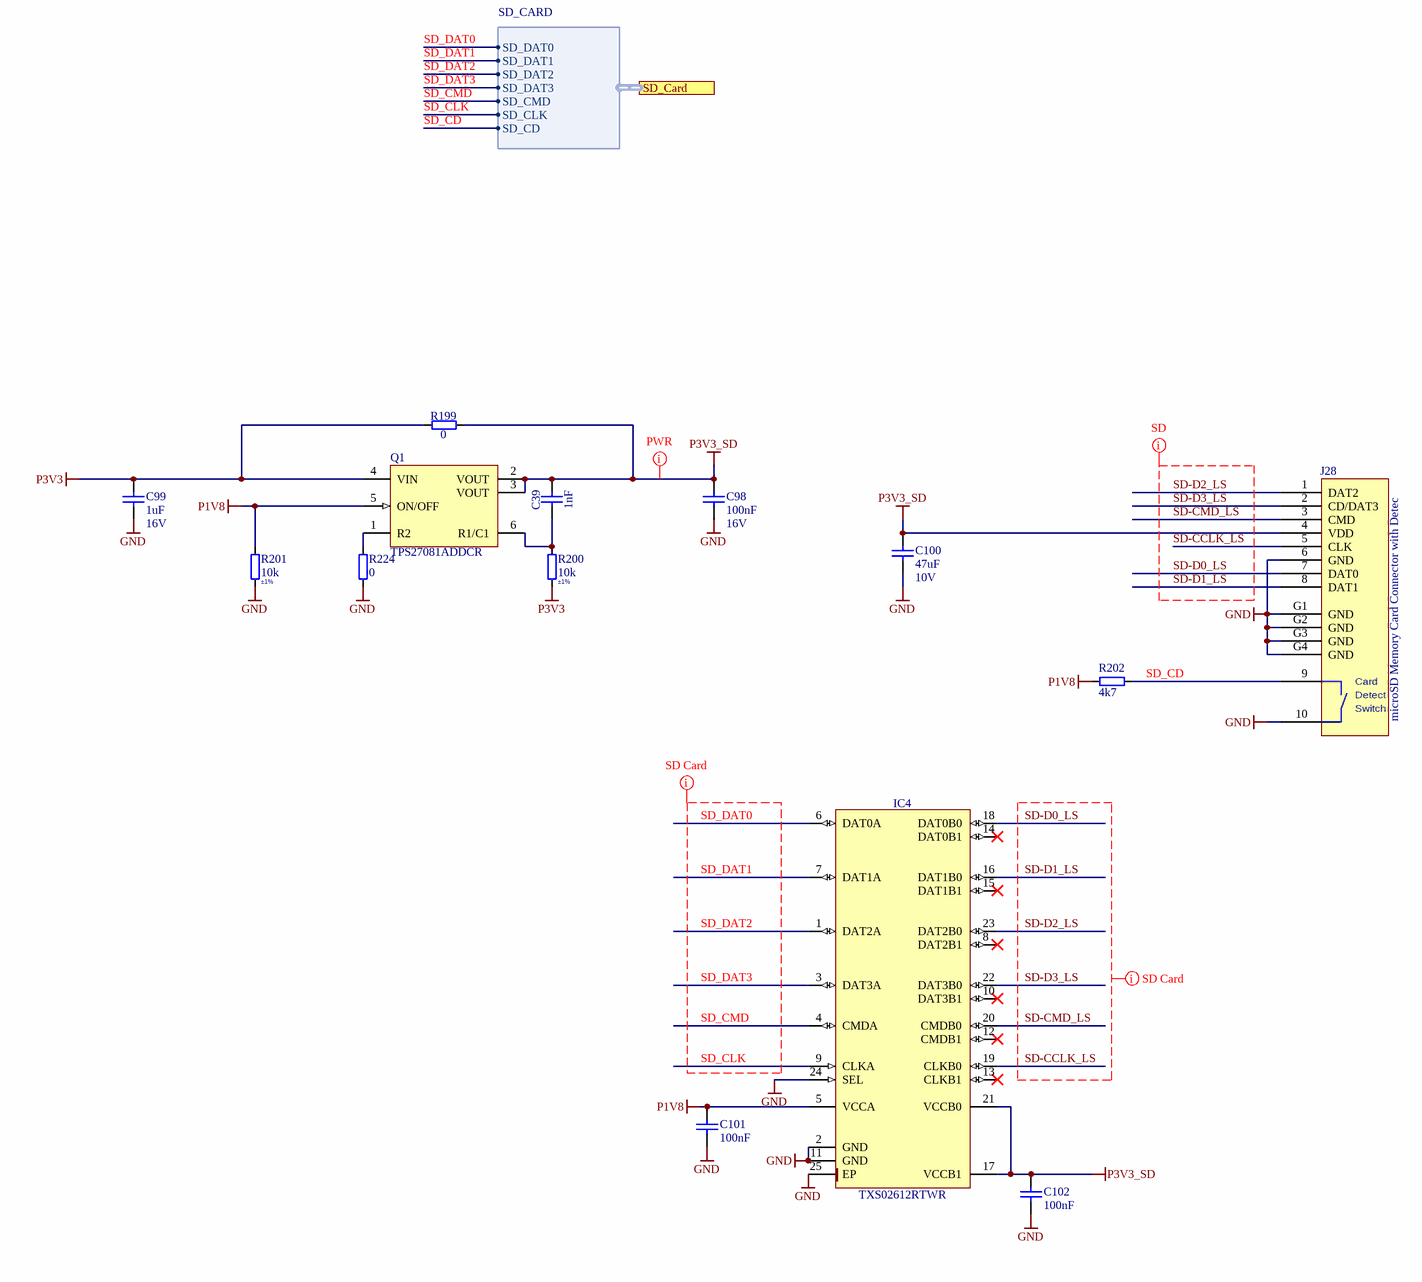
[diagram p4: SD.SchDoc]

### Parts
C39  1nF  [CAPC1005X55N]
C98  100nF  Voltage: 16V  [CAPC1005X55N]
C99  1uF  Voltage: 16V  [CAPC1005X55N]
C100  47uF  Voltage: 10V  [CAPC3216X180N]
C101  100nF  [CAPC1005X55N]
C102  100nF  [CAPC1005X55N]
IC4  TXS02612RTWR  [QFN50P400X400X80-25N-S255]
J28  microSD Memory Card Connector with Detec  [104031-0811]
Q1  TPS27081ADDCR  [SOT95P280X110-6N]
R199  0  [RESC2012X60N]
R200  10k  Tolerance: ±1%  [RESC1005X40N]
R201  10k  Tolerance: ±1%  [RESC1005X40N]
R202  4k7  [RESC1005X40N]
R224  0  [RESC1005X40N]

### Ports
SD_Card (harness SD_CARD)

### Harnesses
SD_CARD: SD_DAT0, SD_DAT1, SD_DAT2, SD_DAT3, SD_CMD, SD_CLK, SD_CD

### Nets
GND: C98.1 C99.2 C100.1 C101.2 C102.2 IC4.2(GND) IC4.11(GND) IC4.24(SEL) IC4.25(EP) J28.6(GND) J28.10(CDSW) J28.G1(GND) J28.G2(GND) J28.G3(GND) J28.G4(GND) R201.2 R224.2
P1V8: C101.1 IC4.5(VCCA) Q1.5(ON/OFF) R201.1 R202.2
P3V3: C99.1 Q1.4(VIN) R199.1 R200.2
P3V3_SD: C39.2 C98.2 C100.2 C102.1 IC4.17(VCCB1) IC4.21(VCCB0) J28.4(VDD) Q1.2(VOUT) Q1.3(VOUT) R199.2
SD-CCLK_LS: IC4.19(CLKB0) J28.5(CLK)
SD-CMD_LS: IC4.20(CMDB0) J28.3(CMD)
SD-D0_LS: IC4.18(DAT0B0) J28.7(DAT0)
SD-D1_LS: IC4.16(DAT1B0) J28.8(DAT1)
SD-D2_LS: IC4.23(DAT2B0) J28.1(DAT2)
SD-D3_LS: IC4.22(DAT3B0) J28.2(CD/DAT3)
SD_CD: J28.9(CDSW) R202.1 ; port SD_Card.SD_CD
SD_CLK: IC4.9(CLKA) ; port SD_Card.SD_CLK
SD_CMD: IC4.4(CMDA) ; port SD_Card.SD_CMD
SD_DAT0: IC4.6(DAT0A) ; port SD_Card.SD_DAT0
SD_DAT1: IC4.7(DAT1A) ; port SD_Card.SD_DAT1
SD_DAT2: IC4.1(DAT2A) ; port SD_Card.SD_DAT2
SD_DAT3: IC4.3(DAT3A) ; port SD_Card.SD_DAT3
NetC39_1: C39.1 Q1.6(R1/C1) R200.1
NetQ1_1: Q1.1(R2) R224.1

Not connected (* = marked no-connect by the designer): IC4 8(DAT2B1)* 10(DAT3B1)* 12(CMDB1)* 13(CLKB1)* 14(DAT0B1)* 15(DAT1B1)*

### Layout directives
net class SD: SD-CCLK_LS, SD-CMD_LS, SD-D0_LS, SD-D1_LS, SD-D2_LS, SD-D3_LS
net class SD Card: SD-CCLK_LS, SD-CMD_LS, SD-D0_LS, SD-D1_LS, SD-D2_LS, SD-D3_LS, SD_CLK, SD_CMD, SD_DAT0, SD_DAT1, SD_DAT2, SD_DAT3
net class PWR: P3V3_SD

### Notes on the sheet
- Project/Equipment
- Document
- Designer
- Drawn by
- Check.by
- Copyright WUT ISE 2020.
  This documentation describes Open Hardware and is licensed under the CERN OHL v.1.2. You may redistribute and modify this documentation under the terms of the CERN OHL v.1.2. (http://ohwr.org/CERNOHL). This documentation is distributed WITHOUT ANY EXPRESS OR IMPLIED WARRANTY, INCLUDING OF MERCHANTABILITY, SATISFACTORY QUALITY AND FITNESS FOR A PARTICULAR PURPOSE. Please see the CERN OHL v.1.2 for applicable conditions.
- Contact
- File
- Last Mod.
- Print Date
- Sheet
- Size
- A3
- of
- Rev
- (in symbol 26322) Card; Detect; Switch

### Library data of the parts
C39 = CC0402_1NF_50V_10%_X7R: Non-polarised capacitor; Part Description: SMD Multilayer Chip Ceramic Capacitor; Manufacturer: GENERIC; Manufacturer1 Part Number: 223858715623; Voltage: 50V; TC: X7R; Tolerance: ±10%; Part Number: CC0402_1NF_50V_10%_X7R; Component Kind: Standard; Component Type: Standard; Pin Count: 2; Value: 1nF; Status: Not Recommended; Manufacturer Part Number: CC0402_1NF_50V_10%_X7R; Case: 0402; Mounted: Yes; Socket: No; SMD: Yes; Sense: No; Manufacturer1 Example: PHYCOMP; Manufacturer1 ComponentHeight: 0.55mm; HelpURL: \\cern.ch\dfs\Applications\Altium\Datasheets\CC0402_X7R_PHYCOMP.pdf; Author: CERN DEM JLC; CreateDate: 03.12.2007; LatestRevisionDate: 03.12.2007
C98 = CC0402_100NF_16V_10%_X7R: Non-polarised capacitor; Part Description: SMD Multilayer Chip Ceramic Capacitor; Manufacturer: GENERIC; Manufacturer1 Part Number: GRM155R71C104KA88D; TC: X7R; Tolerance: ±10%; Case: 0402; Value: 100nF; Part Number: CC0402_100NF_16V_10%_X7R; Component Kind: Standard; Component Type: Standard; Pin Count: 2; Status: Not Recommended; Manufacturer Part Number: CC0402_100NF_16V_10%_X7R; Mounted: Yes; Socket: No; SMD: Yes; Sense: No; Manufacturer1 Example: MURATA; Manufacturer1 ComponentHeight: 0.55mm; HelpURL: \\cern.ch\dfs\Applications\Altium\Datasheets\CC0402_X7R_MURATA_GRM.pdf; Author: CERN DEM JLC; CreateDate: 05.12.2013; LatestRevisionDate: 03.12.2007
C99 = CC0402_1UF_16V_10%_X5R: Non-polarised capacitor; Part Description: SMD Multilayer Chip Ceramic Capacitor; Manufacturer: GENERIC; Manufacturer1 Part Number: C1005X5R1C105KT; Tolerance: ±10%; TC: X5R; Case: 0402; Value: 1uF; Part Number: CC0402_1UF_16V_10%_X5R; Component Kind: Standard; Component Type: Standard; Pin Count: 2; Status: Preferred; Manufacturer Part Number: CC0402_1UF_16V_10%_X5R; Mounted: Yes; Socket: No; SMD: Yes; Sense: No; Manufacturer1 Example: TDK; Manufacturer1 ComponentHeight: 0.55mm; HelpURL: \\cern.ch\dfs\Applications\Altium\Datasheets\CC0402_X5R_TDK_C.pdf; Author: CERN DEM JLC; CreateDate: 25.10.2012; LatestRevisionDate: 25.10.2012
C100 = CC1206_47UF_10V_10%_X5R: Non-polarised capacitor; Part Description: SMD Multilayer Chip Ceramic Capacitor; Manufacturer: GENERIC; Manufacturer1 Part Number: GRM31CR61A476KE15; Tolerance: ±10%; TC: X5R; Case: 1206; Value: 47uF; Part Number: CC1206_47UF_10V_10%_X5R; Component Kind: Standard; Component Type: Standard; Pin Count: 2; Status: None; Manufacturer Part Number: CC1206_47UF_10V_10%_X5R; Mounted: Yes; Socket: No; SMD: Yes; Sense: No; Manufacturer1 Example: MURATA; Manufacturer1 ComponentHeight: 1.8mm; HelpURL: \\cern.ch\dfs\Applications\Altium\Datasheets\CC1206_X5R_MURATA_GRM.pdf; Author: CERN DEM MR; CreateDate: 24.06.2016; LatestRevisionDate: 24.06.2016
C101 C102 = CC0402_100NF_16V_10%_X7R: as C225 on sheet AWG_CLK_Connectors; Case: 0402; Value: 100nF; Part Number: CC0402_100NF_16V_10%_X7R; Component Kind: Standard; Component Type: Standard; Pin Count: 2; Status: Not Recommended; Manufacturer Part Number: CC0402_100NF_16V_10%_X7R; Mounted: Yes; Socket: No; SMD: Yes; Sense: No; Manufacturer1 Example: MURATA; Manufacturer1 ComponentHeight: 0.55mm; HelpURL: \\cern.ch\dfs\Applications\Altium\Datasheets\CC0402_X7R_MURATA_GRM.pdf; Author: CERN DEM JLC; CreateDate: 05.12.2013; LatestRevisionDate: 03.12.2007
IC4 = TXS02612RTWR: SDIO Port Expander With Voltage-Level Translation; Manufacturer: TEXAS INSTRUMENTS; PressFit: No; Bonding: No; Part Number: TXS02612RTWR; Component Kind: Standard; Component Type: Standard; Device: TXS02612RTWR; PackageDescription: QFN, 0.50mm Pitch, Square; 24 Pin, 4.00mm L X 4.00mm W X 0.80mm H body (w/Thermal Tab 2.55 X 2.55mm), IPC Medium Density; Part Description: SDIO Port Expander with Voltage-Level Translation; Manufacturer Part Number: TXS02612RTWR; Pin Count: 25; Case: QFN24; Mounted: Yes; Socket: No; SMD: Yes; Sense: No; ComponentHeight: 0.8mm; Author: CERN DEM JLC; HelpURL: \\cern.ch\dfs\Applications\Altium\Datasheets\TXS02612RTWR.pdf; CreateDate: 19.11.2014; LatestRevisionDate: 19.11.2014
J28 = 26322: microSD Memory Card Connector with Detect Switch; Manufacturer Part Number: Molex 104031-0811; AN: 26322; Mixed: SMT; Trenz-Stock: Yes; Temperature-Range: -25/+85; Case: microSD; HelpURL: B:\AD\adlib\datasheet\104031-0811; H-ART: 104031-0811; Storage-Temperature: -10/+60
Q1 = 29262: AN: 29262; Mixed: SMT; Temperature-Range: -40/+85; Extra: 1.2V - 8V, 3A PFET High-Side Load Switch; Case: SOT23-6; HelpURL: b:\AD\adlib\datasheet\TPS27081A\; Manufacturer Part Number: TPS27081ADDCR
R199 = R0805_0R_JUMPER: Resistor; Part Description: 2A (0.05R Max DC Resistance) Zero Ohm Jumper; Manufacturer: GENERIC; Manufacturer1 Part Number: NRC10Z0; PressFit: No; Part Number: R0805_0R_JUMPER; Component Kind: Standard; Component Type: Standard; Pin Count: 2; Value: 0; Status: Preferred; Manufacturer Part Number: R0805_0R_JUMPER; Case: 0805; Mounted: Yes; Sense: No; Socket: No; SMD: Yes; Manufacturer1 Example: NIC COMPONENT; Manufacturer1 ComponentHeight: 0.6mm; HelpURL: \\cern.ch\dfs\Applications\Altium\Datasheets\R0805_NIC_NRC.pdf; Author: CERN DEM JLC; CreateDate: 03.12.2007; LatestRevisionDate: 13.03.2008
R200 R201 = R0402_10K_1%_0.0625W_100PPM: as R3#1 on sheet RFSOC_SAWG; Case: 0402; Value: 10k; Part Number: R0402_10K_1%_0.0625W_100PPM; Component Kind: Standard; Component Type: Standard; Pin Count: 2; Status: Not Recommended; Power: 0.0625W; Manufacturer Part Number: R0402_10K_1%_0.0625W_100PPM; Mounted: Yes; Sense: No; Socket: No; SMD: Yes; Manufacturer1 Example: YAGEO PHYCOMP; Manufacturer1 ComponentHeight: 0.4mm; HelpURL: \\cern.ch\dfs\Applications\Altium\Datasheets\R0402_Phycomp_RC0402.pdf; Author: CERN DEM JLC; CreateDate: 03.12.2007; LatestRevisionDate: 17.10.2012
R202 = R0402_4K7_1%_0.0625W_100PPM: as R23 on sheet FireFly_AB; Case: 0402; Value: 4k7; Tolerance: ±1%; HelpURL: \\cern.ch\dfs\Applications\Altium\Datasheets\R0402_Phycomp_RC0402.pdf; Part Number: R0402_4K7_1%_0.0625W_100PPM; Component Kind: Standard; Component Type: Standard; Pin Count: 2; Status: Not Recommended; Power: 0.0625W; Manufacturer Part Number: R0402_4K7_1%_0.0625W_100PPM; Mounted: Yes; Sense: No; Socket: No; SMD: Yes; Manufacturer1 Example: YAGEO PHYCOMP; Manufacturer1 ComponentHeight: 0.4mm; Author: CERN DEM JLC; CreateDate: 03.12.2007; LatestRevisionDate: 17.10.2012
R224 = R0402_0R_JUMPER: as R106 on sheet RFSOC_SAWG; Case: 0402; Value: 0; Part Number: R0402_0R_JUMPER; Component Kind: Standard; Component Type: Standard; Pin Count: 2; Status: Not Recommended; Manufacturer Part Number: R0402_0R_JUMPER; Mounted: Yes; Sense: No; Socket: No; SMD: Yes; Manufacturer1 Example: YAGEO PHYCOMP; Manufacturer1 ComponentHeight: 0.4mm; HelpURL: \\cern.ch\dfs\Applications\Altium\Datasheets\R0402_Phycomp_RC0402.pdf; Author: CERN DEM JLC; CreateDate: 03.12.2007; LatestRevisionDate: 17.10.2012